# EAGLE design MCP2515-2561 CAN brekaout (EAGLE 9.0.1)
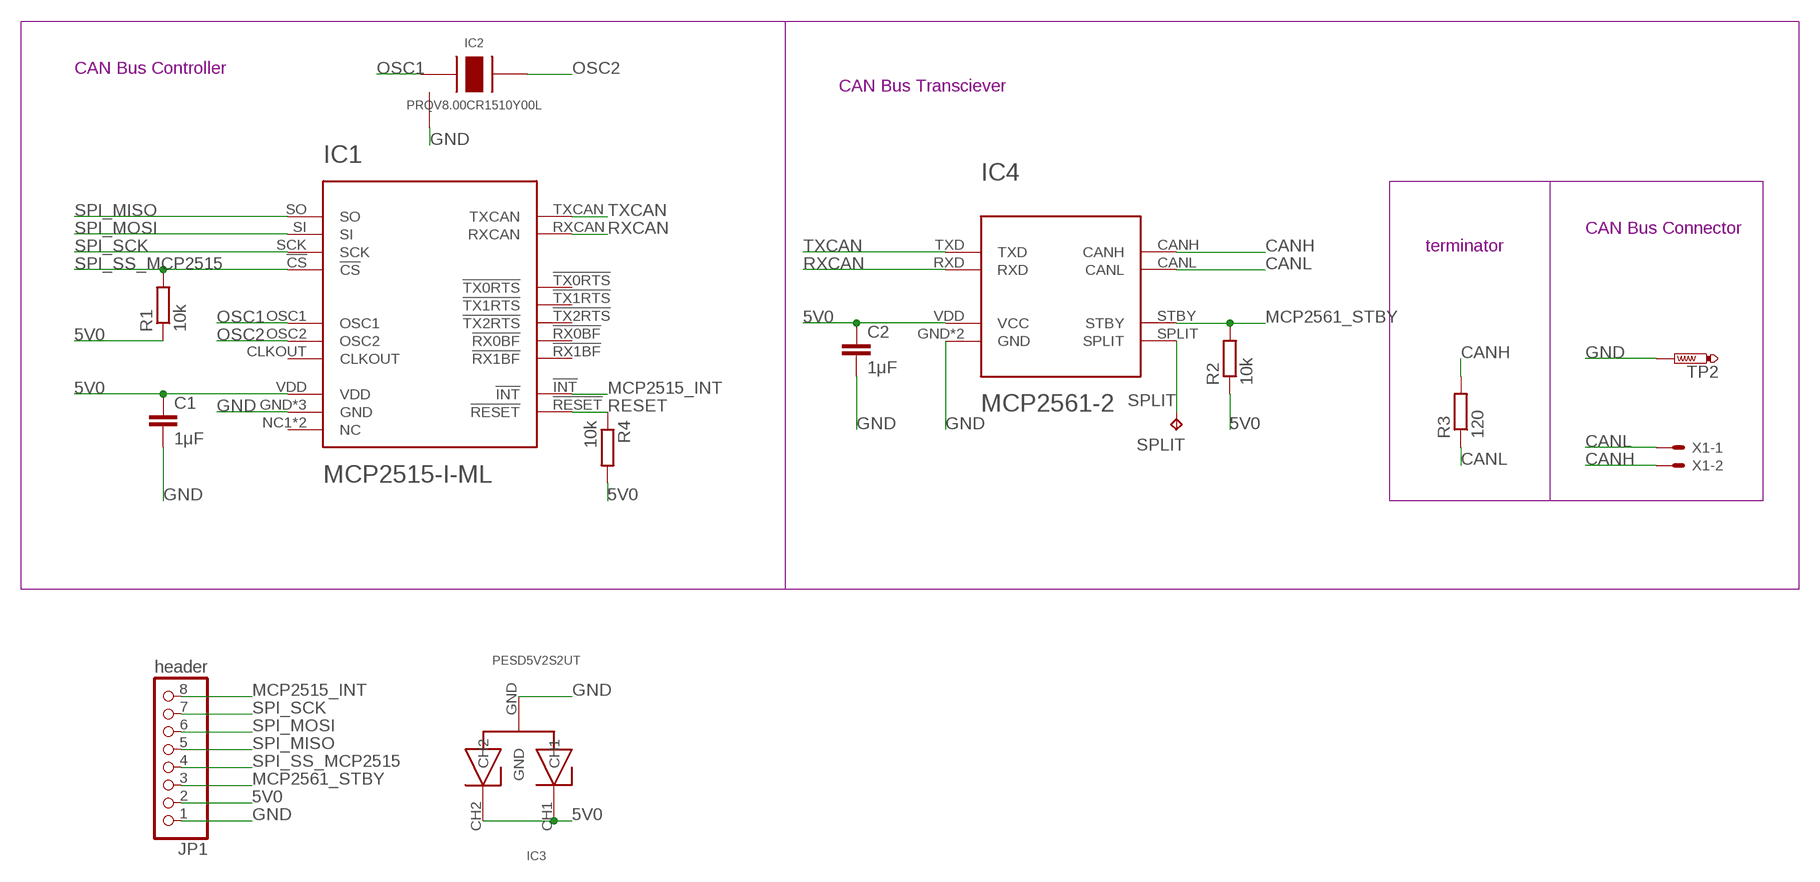
[diagram p0: schematic, sheet 1]

## Parts
C1  1μF  C-EUC0402  [C0402]
C2  1μF  C-EUC0402  [C0402]
IC1  MCP2515-I-ML  [QFN20]
IC2  PRQV8.00CR1510Y00L  PRQV  [SMT]
IC3  PESD5V2S2UT  PESDXS2UT  [SOT-23]
IC4  MCP2561-2  [DFN10]
JP1  header  PINHD-1X8  [1X08]
R1  10k  R-EU_R0402  [R0402]
R2  10k  R-EU_R0402  [R0402]
R3  120  R-EU_R0805  [R0805]
R4  10k  R-EU_R0402  [R0402]
SPLIT  TPB2,54  [B2,54]
TP2  PTR1PAD1-13Y  [P1-13Y]
X1  22-23-2021  [22-23-2021]

## Nets
5V0: C1.1 C2.1 IC1.VDD IC3.CH1 IC3.CH2 IC4.VDD(VCC) JP1.2 R1.1 R2.1 R4.2
CANH: IC4.CANH R3.2 X1.2
CANL: IC4.CANL R3.1 X1.1
GND: C1.2 C2.2 IC1.GND IC1.GND1(GND) IC1.GND6(GND) IC2.GND IC3.GND IC4.GND IC4.VSS(GND) JP1.1 TP2.TP
MCP2515_INT: IC1.!INT! JP1.8
MCP2561_STBY: IC4.STBY JP1.3 R2.2
OSC1: IC1.OSC1 IC2.XTAL1
OSC2: IC1.OSC2 IC2.XTAL2
RESET: IC1.!RESET! R4.1
RXCAN: IC1.RXCAN IC4.RXD
SPI_MISO: IC1.SO JP1.5
SPI_MOSI: IC1.SI JP1.6
SPI_SCK: IC1.SCK JP1.7
SPI_SS_MCP2515: IC1.!CS! JP1.4 R1.2
SPLIT: IC4.SPLIT SPLIT.TP
TXCAN: IC1.TXCAN IC4.TXD
Unconnected: IC1.!RX0BF! IC1.!RX1BF! IC1.!TX0RTS! IC1.!TX1RTS! IC1.!TX2RTS! IC1.CLKOUT IC1.NC1(NC) IC1.NC2(NC)

## Notes on the sheet
- CAN Bus Controller
- CAN Bus Transciever
- CAN Bus Connector
- terminator

## Library data of the parts
C1 C2 = rcl:C-EU: CAPACITOR, European symbol
IC1 = MCP2515-I-ML - Standalonce CAN Controller with SPI Interface:MCP2515-I-ML
IC2 = PRQV8.00CR1510Y00L - 8MHz resonator:PRQV
IC3 = PESDxS2UT:PESDXS2UT
IC4 = MCP2561-2 - High-Speed CAN Transceiver:MCP2561-2
JP1 = pinhead:PINHD-1X8: PIN HEADER
R1-R4 = rcl:R-EU_: RESISTOR, European symbol
SPLIT = testpad:TP: Test pad
TP2 = testpad:PTR1: TEST PIN
X1 = con-molex:22-23-2021: .100" (2.54mm) Center Header - 2 Pin; MF: MOLEX; MPN: 22-23-2021; OC_FARNELL: 1462926; OC_NEWARK: 25C3832

## Board
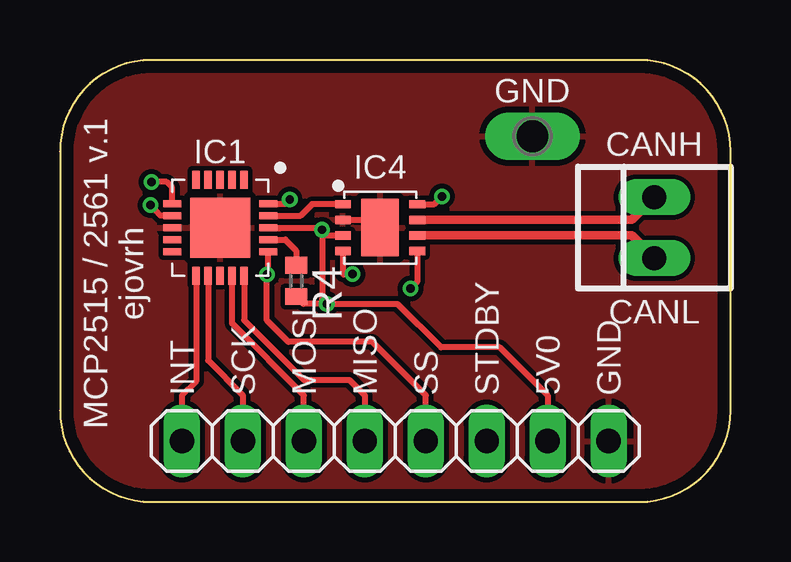
[diagram p1: board, top side]
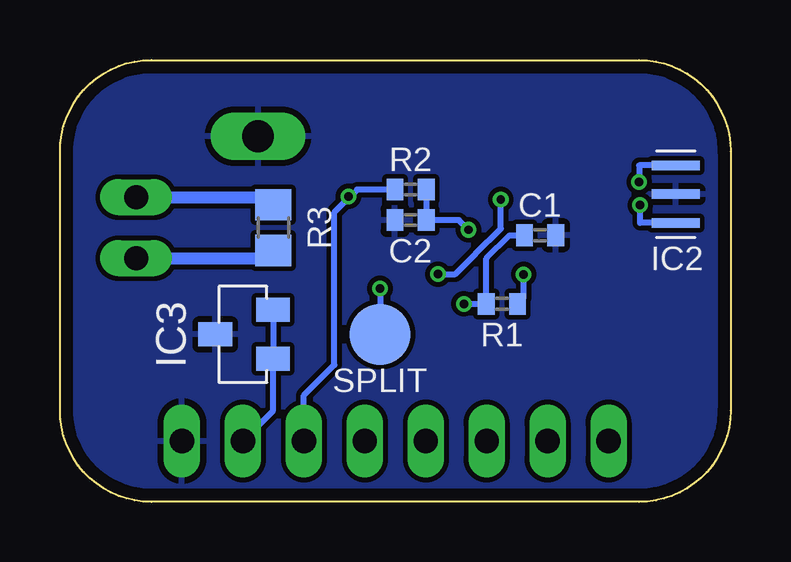
[diagram p2: board, bottom side, seen from below]

Size 27.94 x 18.41 mm. Coordinates in mm from the lower left corner, seen from the top.
Outline: 24.13,18.41 3.81,18.41 arc90 0,14.61 0,3.81 arc90 3.81,0 24.13,0 arc90 27.94,3.81 27.94,14.61 arc90 24.13,18.41
Copper layers (1*16): Top 0.035mm / dielectric 1.5mm / Bottom 0.035mm
Design rules "markovac_2layer": minimum track width 0.2mm, minimum drill 0.35mm, track to track 0.2mm, track to pad 0.2mm, pad to pad 0.2mm, via to via 0.2mm, smd to smd 0.2mm, copper to edge 0.5mm, drill to drill 8mil, minimum pad ring 0.15mm, minimum via ring 0.15mm, stop-mask expansion 4mil, vias tented up to drill 0.35mm, thermal gap 10mil

### Footprints (pad centres in the part's own frame; a part is rotated, then mirrored left to right if it is on the bottom)
C0402 = smd 0.7 x 0.9: 1 -0.65,0; 2 0.65,0
QFN20 = smd 0.3 x 0.75: !CS! 1,2; !RESET! 0.5,2; !RX0BF! 1,-2; !RX1BF! 0.5,-2; GND6 0,-2; OSC1 -0.5,-2; OSC2 -1,-2; RXCAN -1,2; TXCAN -0.5,2; VDD 0,2 | smd 0.75 x 0.3: !INT! 2,-1; !TX0RTS! -2,0.5; !TX1RTS! -2,0; !TX2RTS! -2,-1; CLKOUT -2,1; NC1 -2,-0.5; NC2 2,0; SCK 2,-0.5; SI 2,0.5; SO 2,1 | smd 2.5 x 2.5: GND 0,0; GND1 0,0
SMT = smd 0.4 x 2: GND 0,0; XTAL1 -1.2,0; XTAL2 1.2,0
SOT-23 = smd 1 x 1.4: CH1 -1.016,-1.262; CH2 1.016,-1.262; GND 0,1.151
DFN10 = smd 0.35 x 0.65: CANH -0.325,1.55; CANL 0.325,1.55; RXD 0.975,-1.55; SPLIT 0.975,1.55; STBY -0.975,1.55; TXD -0.975,-1.55; VDD 0.325,-1.55; VSS -0.325,-1.55 | smd 2.4 x 1.55: GND 0,0
1X08 = drill 1.016 long: 1 -8.89,0; 2 -6.35,0; 3 -3.81,0; 4 -1.27,0; 5 1.27,0; 6 3.81,0; 7 6.35,0; 8 8.89,0
R0402 = smd 0.7 x 0.9: 1 -0.65,0; 2 0.65,0
R0805 = smd 1.3 x 1.5: 1 -0.95,0; 2 0.95,0
B2,54 = smd 2.54 x 2.54: TP 0,0
P1-13Y = drill 1.321 pad 1.905 long: TP 0,0
22-23-2021 = drill 1 long: 1 -1.27,0; 2 1.27,0

### Placement (x,y rotation side)
C1  7.94,11.11 0 bottom
C2  13.34,11.75 180 bottom
IC1  6.67,11.43 270 top
IC2  2.29,12.83 90 bottom
IC3  20.32,6.99 90 bottom
IC4  13.34,11.43 270 top
JP1  13.97,2.54 180 top
R1  9.53,8.26 0 bottom
R2  13.34,13.02 180 bottom
R3  19.05,11.43 90 bottom
R4  9.84,9.21 270 top
SPLIT  14.61,6.99 180 bottom
TP2  19.68,15.24 270 top
X1  24.77,11.43 90 top

### Tracks (layer width: path | path; a pad name or v marks a point on that pad's centre or on a via)
5V0  (via drill 0.35)
  Top 0.254: IC4.VDD 11.11,11.11 10.87,11.34 | 9.18,11.41 8.69,11.41 IC1.VDD 10.79,11.43 10.87,11.34 | JP1.2 20.32,4.45 18.32,6.44 15.88,6.44 14.06,8.26 v11.11,8.26 | v11.11,8.26 10.14,8.26 R4.2 | v11.11,8.26 10.92,8.45 v10.92,11.34 10.87,11.34
  Bottom 0.254: IC3.CH2 IC3.CH1 19.06,3.8 JP1.2 | R2.1 C2.1 11.32,11.75 v10.92,11.34 | C1.1 9.21,11.11 10.18,10.14 R1.1 v11.11,8.26
CANH
  Top 0.356: IC4.CANH 23.82,11.76 X1.2
  Bottom 0.508: X1.2 19.37,12.7 R3.2
CANL
  Top 0.356: IC4.CANL 23.82,11.11 X1.1
  Bottom 0.508: X1.1 19.37,10.16 R3.1
GND
  Top 0.254: IC4.VSS 13.01,11.76 IC4.GND
  pour Top: 0,0 27.94,0 27.94,18.41 0,18.41
  pour Bottom: 0,0 27.94,0 27.94,18.41 0,18.41
MCP2515_INT
  Top 0.254: IC1.!INT! 5.67,5.03 5.08,4.45 JP1.8
MCP2561_STBY  (via drill 0.35)
  Top 0.254: IC4.STBY 15.59,12.4 v15.92,12.73
  Bottom 0.254: v15.92,12.73 15.88,12.7 | JP1.3 17.78,4.45 16.51,5.71 16.51,12.06 15.88,12.7 | R2.2 15.56,13.02 15.88,12.7
OSC1  (via drill 0.35)
  Top 0.254: v3.77,12.37 3.97,12.17 3.97,12.14 4.18,11.93 IC1.OSC1
  Bottom 0.254: IC2.XTAL1 3.77,11.63 v3.77,12.37
OSC2  (via drill 0.35)
  Top 0.254: IC1.OSC2 4.67,13.11 4.45,13.34 v3.81,13.34
  Bottom 0.254: IC2.XTAL2 3.81,14.03 v3.81,13.34
RESET
  Top 0.254: 8.69,10.91 IC1.!RESET! 9.39,10.93 9.84,10.48 R4.1
RXCAN  (via drill 0.35)
  Top 0.254: IC1.RXCAN 9.4,12.43 v9.57,12.6 | IC4.RXD 11.79,9.49 v12.19,9.49
  Bottom 0.254: v12.19,9.49 11.46,9.49 10.63,10.33 9.57,11.39 v9.57,12.6
SPI_MISO
  Top 0.254: JP1.5 12.7,4.45 12.06,5.08 10.16,5.08 7.67,7.58 IC1.SO
SPI_MOSI
  Top 0.254: JP1.6 10.16,4.45 7.17,7.44 IC1.SI
SPI_SCK
  Top 0.254: IC1.SCK 6.17,5.9 7.62,4.45 JP1.7
SPI_SS_MCP2515  (via drill 0.35)
  Top 0.254: JP1.4 15.24,4.45 13.01,6.67 9.52,6.67 8.62,7.57 v8.62,9.48 | v8.62,9.48 8.67,9.53 IC1.!CS! 8.67,9.53 8.66,9.53 v8.62,9.48
  Bottom 0.254: R1.2 8.62,8.51 v8.62,9.48
SPLIT  (via drill 0.35)
  Top 0.254: IC4.SPLIT 14.88,9.17 v14.61,8.89
  Bottom 0.254: v14.61,8.89 SPLIT.TP
TXCAN
  Top 0.254: IC1.TXCAN 10.03,11.93 10.5,12.4 IC4.TXD

### Text on the board
tPlace: GND | INT | SCK | MOSI | MISO | SS | STDBY | 5V0 | GND
tNames: CANH | MCP2515 / 2561 v.1 / ejovrh | CANL